# EAGLE schematic Board (EAGLE 7.1.0)
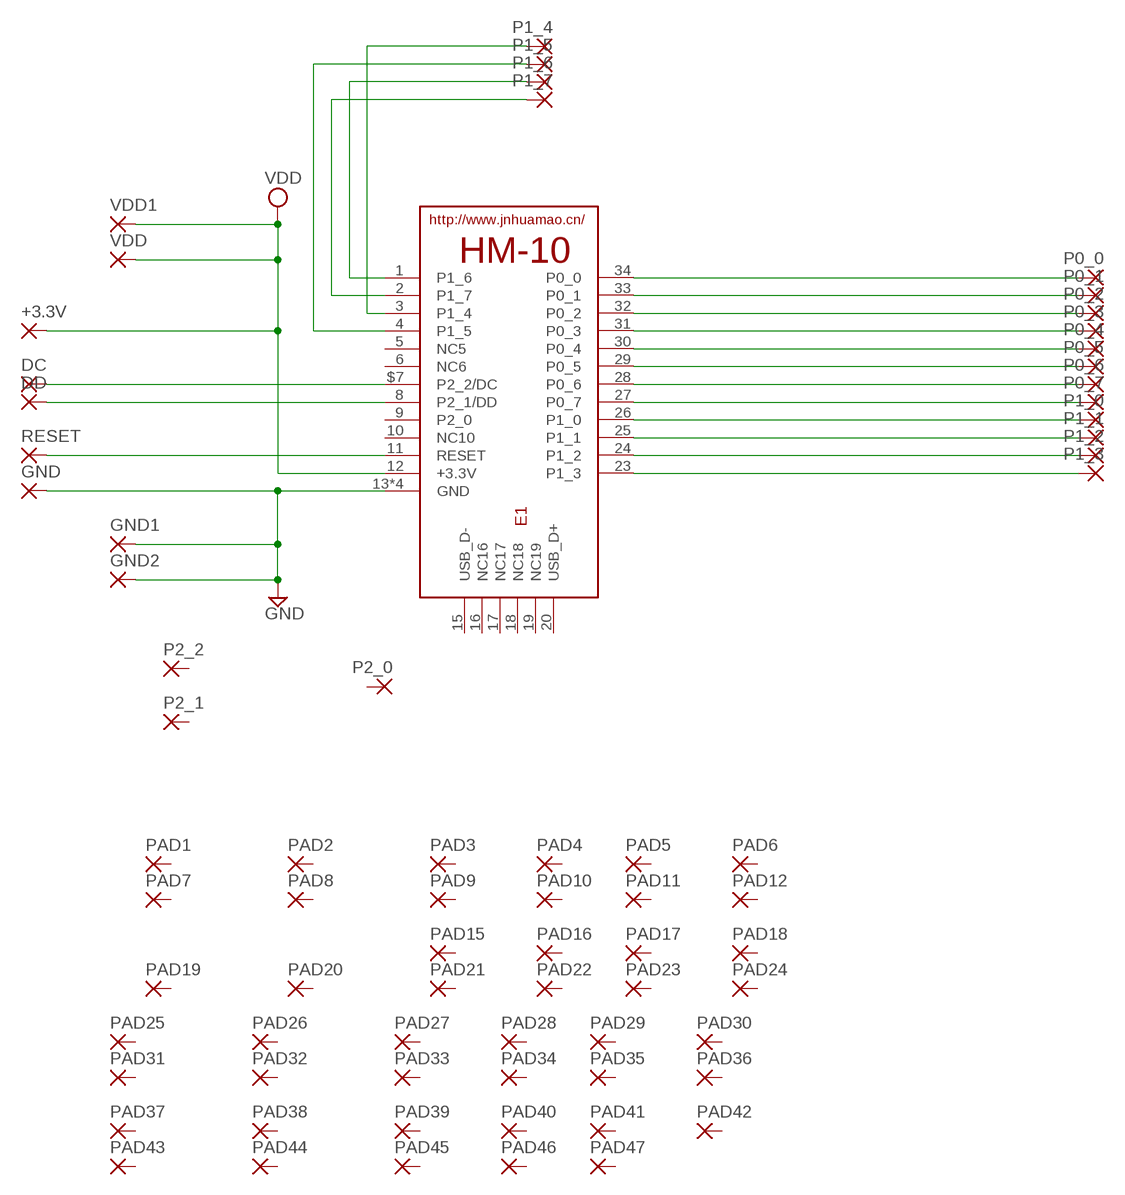
[diagram p0: schematic, sheet 1]

## Parts
+3.3V  SMD2  [SMD1,27-2,54]
DC  SMD2  [SMD1,27-2,54]
DD  SMD2  [SMD1,27-2,54]
E1  HM-10-BOARD  [26.9X13X2.2_BOARD]
GND  SMD2  [SMD1,27-2,54]
GND1  1,6/0,9  [1,6/0,9]
GND2  1,6/0,9  [1,6/0,9]
P0_0  1,6/0,9  [1,6/0,9]
P0_1  1,6/0,9  [1,6/0,9]
P0_2  1,6/0,9  [1,6/0,9]
P0_3  1,6/0,9  [1,6/0,9]
P0_4  1,6/0,9  [1,6/0,9]
P0_5  1,6/0,9  [1,6/0,9]
P0_6  1,6/0,9  [1,6/0,9]
P0_7  1,6/0,9  [1,6/0,9]
P1_0  1,6/0,9  [1,6/0,9]
P1_1  1,6/0,9  [1,6/0,9]
P1_2  1,6/0,9  [1,6/0,9]
P1_3  1,6/0,9  [1,6/0,9]
P1_4  1,6/0,9  [1,6/0,9]
P1_5  1,6/0,9  [1,6/0,9]
P1_6  1,6/0,9  [1,6/0,9]
P1_7  1,6/0,9  [1,6/0,9]
P2_0  1,6/0,9  [1,6/0,9]
P2_1  1,6/0,9  [1,6/0,9]
P2_2  1,6/0,9  [1,6/0,9]
PAD1  1,6/0,9  [1,6/0,9]
PAD2  1,6/0,9  [1,6/0,9]
PAD3  1,6/0,9  [1,6/0,9]
PAD4  1,6/0,9  [1,6/0,9]
PAD5  1,6/0,9  [1,6/0,9]
PAD6  1,6/0,9  [1,6/0,9]
PAD7  1,6/0,9  [1,6/0,9]
PAD8  1,6/0,9  [1,6/0,9]
PAD9  1,6/0,9  [1,6/0,9]
PAD10  1,6/0,9  [1,6/0,9]
PAD11  1,6/0,9  [1,6/0,9]
PAD12  1,6/0,9  [1,6/0,9]
PAD15  1,6/0,9  [1,6/0,9]
PAD16  1,6/0,9  [1,6/0,9]
PAD17  1,6/0,9  [1,6/0,9]
PAD18  1,6/0,9  [1,6/0,9]
PAD19  1,6/0,9  [1,6/0,9]
PAD20  1,6/0,9  [1,6/0,9]
PAD21  1,6/0,9  [1,6/0,9]
PAD22  1,6/0,9  [1,6/0,9]
PAD23  1,6/0,9  [1,6/0,9]
PAD24  1,6/0,9  [1,6/0,9]
PAD25  1,6/0,9  [1,6/0,9]
PAD26  1,6/0,9  [1,6/0,9]
PAD27  1,6/0,9  [1,6/0,9]
PAD28  1,6/0,9  [1,6/0,9]
PAD29  1,6/0,9  [1,6/0,9]
PAD30  1,6/0,9  [1,6/0,9]
PAD31  1,6/0,9  [1,6/0,9]
PAD32  1,6/0,9  [1,6/0,9]
PAD33  1,6/0,9  [1,6/0,9]
PAD34  1,6/0,9  [1,6/0,9]
PAD35  1,6/0,9  [1,6/0,9]
PAD36  1,6/0,9  [1,6/0,9]
PAD37  1,6/0,9  [1,6/0,9]
PAD38  1,6/0,9  [1,6/0,9]
PAD39  1,6/0,9  [1,6/0,9]
PAD40  1,6/0,9  [1,6/0,9]
PAD41  1,6/0,9  [1,6/0,9]
PAD42  1,6/0,9  [1,6/0,9]
PAD43  1,6/0,9  [1,6/0,9]
PAD44  1,6/0,9  [1,6/0,9]
PAD45  1,6/0,9  [1,6/0,9]
PAD46  1,6/0,9  [1,6/0,9]
PAD47  1,6/0,9  [1,6/0,9]
RESET  SMD2  [SMD1,27-2,54]
VDD  1,6/0,9  [1,6/0,9]
VDD1  1,6/0,9  [1,6/0,9]

## Nets
GND: E1.13(GND) E1.14(GND) E1.21(GND) E1.22(GND) GND1.1(P) GND2.1(P) GND.1(P)
N$1: E1.28(P0_6) P0_6.1(P)
N$2: E1.27(P0_7) P0_7.1(P)
N$3: E1.11(RESET) RESET.1(P)
N$4: DC.1(P) E1.$7(P2_2/DC)
N$5: DD.1(P) E1.8(P2_1/DD)
N$6: E1.23(P1_3) P1_3.1(P)
N$7: E1.24(P1_2) P1_2.1(P)
N$8: E1.25(P1_1) P1_1.1(P)
N$9: E1.31(P0_3) P0_3.1(P)
N$10: E1.30(P0_4) P0_4.1(P)
N$11: E1.29(P0_5) P0_5.1(P)
N$12: E1.26(P1_0) P1_0.1(P)
N$13: E1.2(P1_7) P1_7.1(P)
N$14: E1.1(P1_6) P1_6.1(P)
N$15: E1.4(P1_5) P1_5.1(P)
N$16: E1.3(P1_4) P1_4.1(P)
N$18: E1.32(P0_2) P0_2.1(P)
P0_0: E1.34(P0_0) P0_0.1(P)
P0_1: E1.33(P0_1) P0_1.1(P)
VDD: +3.3V.1(P) E1.12(+3.3V) VDD1.1(P) VDD.1(P)
Unconnected: E1.5(NC5) E1.6(NC6) E1.9(P2_0) E1.10(NC10) E1.15(USB_D-) E1.16(NC16) E1.17(NC17) E1.18(NC18) E1.19(NC19) E1.20(USB_D+) P2_0.1(P) P2_1.1(P) P2_2.1(P) PAD1.1(P) PAD2.1(P) PAD3.1(P) PAD4.1(P) PAD5.1(P) PAD6.1(P) PAD7.1(P) PAD8.1(P) PAD9.1(P) PAD10.1(P) PAD11.1(P) PAD12.1(P) PAD15.1(P) PAD16.1(P) PAD17.1(P) PAD18.1(P) PAD19.1(P) PAD20.1(P) PAD21.1(P) PAD22.1(P) PAD23.1(P) PAD24.1(P) PAD25.1(P) PAD26.1(P) PAD27.1(P) PAD28.1(P) PAD29.1(P) PAD30.1(P) PAD31.1(P) PAD32.1(P) PAD33.1(P) PAD34.1(P) PAD35.1(P) PAD36.1(P) PAD37.1(P) PAD38.1(P) PAD39.1(P) PAD40.1(P) PAD41.1(P) PAD42.1(P) PAD43.1(P) PAD44.1(P) PAD45.1(P) PAD46.1(P) PAD47.1(P)

## Library data of the parts
+3.3V DC DD GND RESET = wirepad:SMD2: SMD PAD
E1 = JHNuaMao:HM-10: HM Bluetooth module use TI CC2540 or CC2541, Master and slave roles in one, transmission version and remote control version and PIO state acquisition functions in one, Support the AT command modify module parameters, Convenient and flexible.
GND1 GND2 P0_0 P0_1-P0_7 P1_0 P1_1-P1_7 P2_0 P2_1 P2_2 PAD1-PAD12 PAD15-PAD47 VDD VDD1 = wirepad:1,6/0,9: THROUGH-HOLE PAD